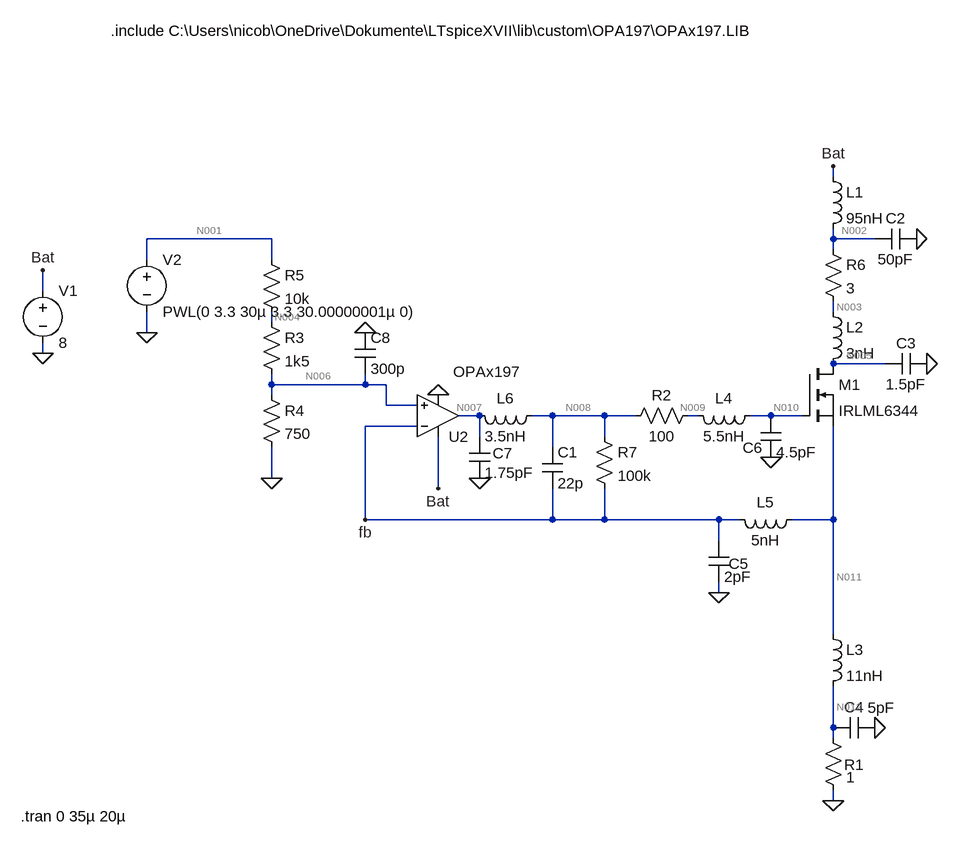
[diagram p0: schematic IR-Led-Driver_26.02.2026 - Kopie.asc]
IR-Led-Driver_26.02.2026 - Kopie.asc, the LTspice schematic file:
Version 4
SHEET 1 1840 776
WIRE 1040 -224 1040 -240
WIRE 176 -128 -16 -128
WIRE 1040 -128 1040 -144
WIRE 1104 -128 1040 -128
WIRE 1040 -112 1040 -128
WIRE -16 -96 -16 -128
WIRE 176 -96 176 -128
WIRE -176 -48 -176 -80
WIRE 1040 -16 1040 -32
WIRE 176 0 176 -16
WIRE -16 16 -16 -16
WIRE -176 48 -176 32
WIRE 1120 64 1040 64
WIRE 176 96 176 80
WIRE 320 96 320 80
WIRE 320 96 176 96
WIRE 352 96 320 96
WIRE 176 112 176 96
WIRE 352 128 352 96
WIRE 400 128 352 128
WIRE 496 144 464 144
WIRE 608 144 576 144
WIRE 688 144 608 144
WIRE 736 144 688 144
WIRE 832 144 816 144
WIRE 944 144 912 144
WIRE 992 144 944 144
WIRE 400 160 320 160
WIRE 496 176 496 144
WIRE 688 176 688 144
WIRE 608 192 608 144
WIRE 176 240 176 192
WIRE 432 256 432 176
WIRE 320 304 320 160
WIRE 608 304 608 256
WIRE 608 304 320 304
WIRE 688 304 688 256
WIRE 688 304 608 304
WIRE 864 304 688 304
WIRE 896 304 864 304
WIRE 1040 304 1040 160
WIRE 1040 304 976 304
WIRE 864 336 864 304
WIRE 864 416 864 400
WIRE 1040 480 1040 304
WIRE 1040 624 1040 560
WIRE 1040 640 1040 624
WIRE 1040 736 1040 720
FLAG -176 -80 Bat
FLAG -176 48 0
FLAG 432 256 Bat
FLAG 1040 736 0
FLAG 1040 -240 Bat
FLAG 176 240 0
FLAG 320 304 fb
FLAG -16 16 0
FLAG 1184 64 0
FLAG 1168 -128 0
FLAG 1104 624 0
FLAG 864 416 0
FLAG 944 208 0
FLAG 496 240 0
FLAG 432 112 0
FLAG 320 16 0
SYMBOL voltage -176 -64 R0
WINDOW 123 0 0 Left 0
WINDOW 39 0 0 Left 0
SYMATTR InstName V1
SYMATTR Value 8
SYMBOL res 1024 624 R0
WINDOW 0 33 57 Left 2
SYMATTR InstName R1
SYMATTR Value 1
SYMBOL nmos 992 64 R0
SYMATTR InstName M1
SYMATTR Value IRLML6344
SYMBOL res 832 128 R90
WINDOW 0 0 56 VBottom 2
WINDOW 3 32 56 VTop 2
SYMATTR InstName R2
SYMATTR Value 100
SYMBOL cap 592 192 R0
SYMATTR InstName C1
SYMATTR Value 22p
SYMBOL OpAmps\\opamp2 432 208 M180
WINDOW 3 23 132 Left 2
SYMATTR Value OPAx197
SYMATTR InstName U2
SYMBOL res 160 -16 R0
SYMATTR InstName R3
SYMATTR Value 1k5
SYMBOL res 160 96 R0
SYMATTR InstName R4
SYMATTR Value 750
SYMBOL res 160 -112 R0
SYMATTR InstName R5
SYMATTR Value 10k
SYMBOL res 1024 -128 R0
SYMATTR InstName R6
SYMATTR Value 3
SYMBOL ind 1024 -240 R0
SYMATTR InstName L1
SYMATTR Value 95nH
SYMBOL ind 1024 -32 R0
SYMATTR InstName L2
SYMATTR Value 3nH
SYMBOL cap 1168 -144 R90
WINDOW 0 0 32 VBottom 2
WINDOW 3 32 32 VTop 2
SYMATTR InstName C2
SYMATTR Value 50pF
SYMBOL cap 1184 48 R90
WINDOW 0 0 32 VBottom 2
WINDOW 3 32 32 VTop 2
SYMATTR InstName C3
SYMATTR Value 1.5pF
SYMBOL ind 1024 464 R0
SYMATTR InstName L3
SYMATTR Value 11nH
SYMBOL cap 1104 608 R90
WINDOW 0 0 32 VBottom 2
WINDOW 3 -30 -10 VTop 2
SYMATTR InstName C4
SYMATTR Value 5pF
SYMBOL cap 848 336 R0
WINDOW 0 31 36 Left 2
SYMATTR InstName C5
SYMATTR Value 2pF
SYMBOL ind 992 288 R90
WINDOW 0 5 56 VBottom 2
WINDOW 3 32 56 VTop 2
SYMATTR InstName L5
SYMATTR Value 5nH
SYMBOL ind 928 128 R90
WINDOW 0 5 56 VBottom 2
WINDOW 3 32 56 VTop 2
SYMATTR InstName L4
SYMATTR Value 5.5nH
SYMBOL cap 928 144 R0
WINDOW 0 -27 49 Left 2
SYMATTR InstName C6
SYMATTR Value 4.5pF
SYMBOL ind 592 128 R90
WINDOW 0 5 56 VBottom 2
WINDOW 3 32 56 VTop 2
SYMATTR InstName L6
SYMATTR Value 3.5nH
SYMBOL cap 480 176 R0
WINDOW 0 36 26 Left 2
SYMATTR InstName C7
SYMATTR Value 1.75pF
SYMBOL voltage -16 -112 R0
WINDOW 123 0 0 Left 0
WINDOW 39 0 0 Left 0
SYMATTR InstName V2
SYMATTR Value PWL(0 3.3 30µ 3.3 30.00000001µ 0)
SYMBOL res 672 160 R0
SYMATTR InstName R7
SYMATTR Value 100k
SYMBOL cap 304 16 R0
SYMATTR InstName C8
SYMATTR Value 300p
TEXT -72 -448 Left 2 !.include C:\\Users\\nicob\\OneDrive\\Dokumente\\LTspiceXVII\\lib\\custom\\OPA197\\OPAx197.LIB
TEXT -210 760 Left 2 !.tran 0 35µ 20µ

The netlist it stands for:
* IR-Led-Driver_26.02.2026 - Kopie.asc
V1 Bat 0 8
R1 N012 0 1
M1 N005 N010 N011 N011 IRLML6344
R2 N009 N008 100
C1 N008 fb 22p
XU2 N006 fb Bat 0 N007 OPAx197  ; pins In+ In- V+ V- OUT
R3 N004 N006 1k5
R4 N006 0 750
R5 N001 N004 10k
R6 N002 N003 3
L1 Bat N002 95nH
L2 N003 N005 3nH
C2 0 N002 50pF
C3 0 N005 1.5pF
L3 N011 N012 11nH
C4 0 N012 5pF
C5 fb 0 2pF
L5 N011 fb 5nH
L4 N010 N009 5.5nH
C6 N010 0 4.5pF
L6 N008 N007 3.5nH
C7 N007 0 1.75pF
V2 N001 0 PWL(0 3.3 30µ 3.3 30.00000001µ 0)
R7 N008 fb 100k
C8 0 N006 300p
.model NMOS NMOS
.model PMOS PMOS
.lib standard.mos
.include C:\Users\nicob\OneDrive\Dokumente\LTspiceXVII\lib\custom\OPA197\OPAx197.LIB
.tran 0 35µ 20µ
.backanno
.end

* Results of the author's LTspice run, read from the files saved beside the schematic
* Operating Point, zero values left out:
*   V(bat) = 8 V
*   V(n012) = 201.9 mV
*   V(n005) = 7.394 V
*   V(n010) = 1.236 V
*   V(n011) = 202.1 mV
*   V(n009) = 1.236 V
*   V(n008) = 1.236 V
*   V(fb) = 202.1 mV
*   V(n007) = 1.236 V
*   V(n006) = 202 mV
*   V(n004) = 606.1 mV
*   V(n001) = 3.3 V
*   V(n002) = 8 V
*   V(n003) = 7.394 V
*   Id(M1) = 201.8 mA
*   Is(M1) = -201.8 mA
*   I(L6) = -10.34 µA
*   I(L5) = -10.34 µA
*   I(L3) = 201.9 mA
*   I(L2) = 201.8 mA
*   I(L1) = 201.8 mA
*   I(R7) = 10.34 µA
*   I(R6) = 201.8 mA
*   I(R5) = 269.4 µA
*   I(R4) = 269.4 µA
*   I(R3) = 269.4 µA
*   I(R1) = 201.9 mA
*   I(V2) = -269.4 µA
*   I(V1) = -202.9 mA
*   Ix(u2:IN+) = -13.91 pA
*   Ix(u2:IN-) = -15.76 pA
*   Ix(u2:VCC) = 1.01 mA
*   Ix(u2:VEE) = -1 mA
*   Ix(u2:OUT) = -10.34 µA
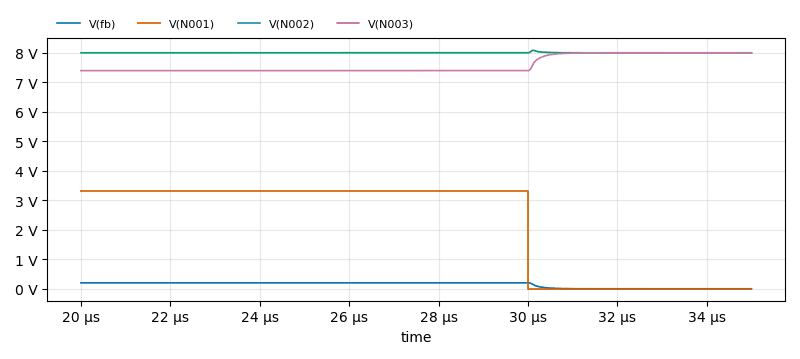
[diagram p1: Transient Analysis of IR-Led-Driver_26.02.2026 - Kopie.asc, plotted from the saved traces]
* Transient Analysis, 1 run:
*   V(fb): min 197.7 µV, max 202.1 mV, average 138.3 mV, rms 166.2 mV, last 197.7 µV
*   V(N001): min 0 V, max 3.3 V, average 2.2 V, rms 2.694 V, last 0 V
*   V(N002): min 8 V, max 8.082 V, average 8.001 V, rms 8.001 V, last 8 V
*   V(N003): min 7.394 V, max 7.999 V, average 7.586 V, rms 7.591 V, last 7.999 V